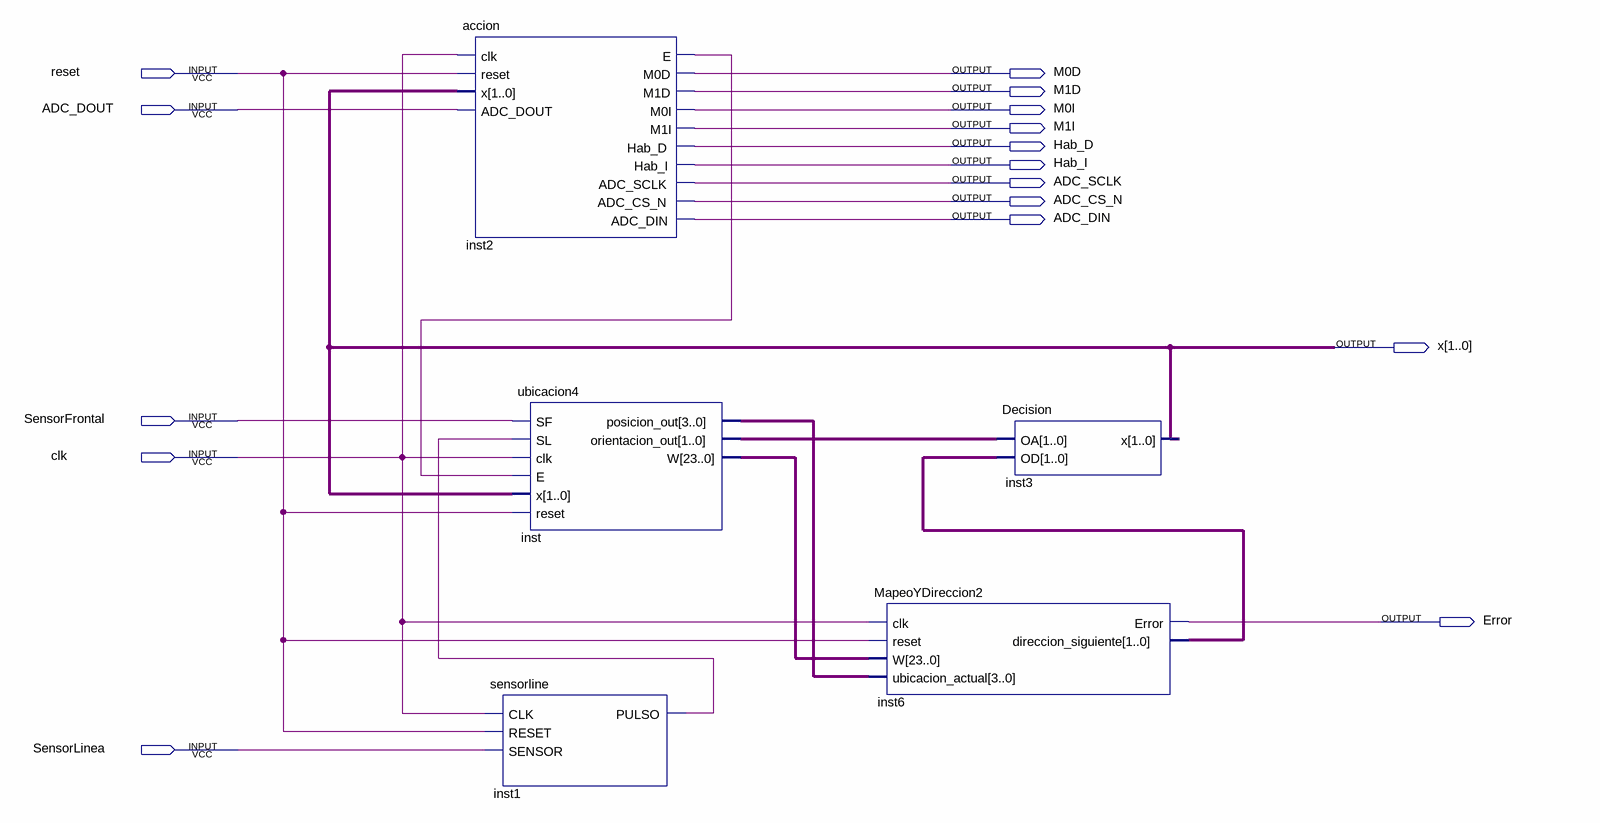
[diagram p0: schematic sheet]
// Quartus schematic TODO.bdf as structural Verilog: 5 symbols, 16 pins
module TODO (
  input  reset,
  input  ADC_DOUT,
  input  SensorFrontal,
  input  clk,
  input  SensorLinea,
  output M0D,
  output M1D,
  output M0I,
  output M1I,
  output Hab_D,
  output Hab_I,
  output ADC_SCLK,
  output ADC_CS_N,
  output ADC_DIN,
  output [1:0] x,
  output Error
);

  wire inst1_pulso, inst2_e;
  wire [1:0] inst6_direccion_siguiente, inst_orientacion_out;
  wire [3:0] inst_posicion_out;
  wire [23:0] inst_w;

  accion inst2 (
    .clk(clk), .reset(reset), .x(x), .ADC_DOUT(ADC_DOUT), .E(inst2_e), .M0D(M0D), .M1D(M1D), .M0I(M0I),
    .M1I(M1I), .Hab_D(Hab_D), .Hab_I(Hab_I), .ADC_SCLK(ADC_SCLK), .ADC_CS_N(ADC_CS_N), .ADC_DIN(ADC_DIN));
  sensorline inst1 (.CLK(clk), .RESET(reset), .SENSOR(SensorLinea), .PULSO(inst1_pulso));
  ubicacion4 inst (
    .SF(SensorFrontal), .SL(inst1_pulso), .clk(clk), .E(inst2_e), .x(x), .reset(reset),
    .posicion_out(inst_posicion_out), .orientacion_out(inst_orientacion_out), .W(inst_w));
  MapeoYDireccion2 inst6 (
    .clk(clk), .reset(reset), .W(inst_w), .ubicacion_actual(inst_posicion_out), .Error(Error),
    .direccion_siguiente(inst6_direccion_siguiente));
  Decision inst3 (.OA(inst_orientacion_out), .OD(inst6_direccion_siguiente), .x(x));
endmodule
